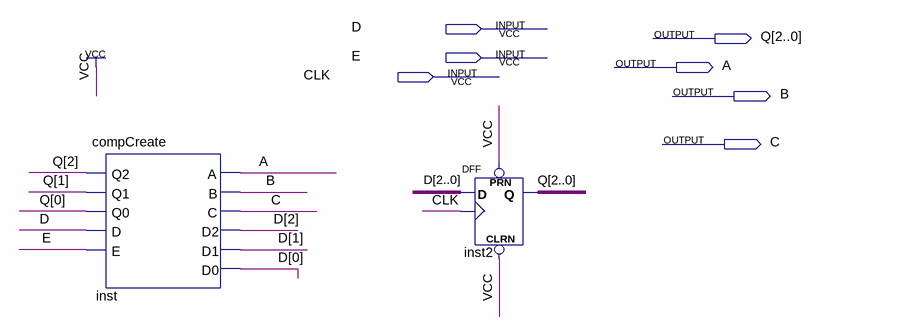
[diagram p0: schematic sheet]
// Quartus schematic Lab5_Quiz.bdf as structural Verilog: 2 symbols, 7 pins
module Lab5_Quiz (
  input  D,
  input  E,
  input  CLK,
  output [2:0] Q,
  output A,
  output B,
  output C
);

  wire [2:0] D_bus;

  compCreate inst (
    .Q2(Q[2]), .Q1(Q[1]), .Q0(Q[0]), .D(D), .E(E), .A(A), .B(B), .C(C), .D2(D_bus[2]), .D1(D_bus[1]),
    .D0(D_bus[0]));
  DFF inst2[2:0] (.CLRN(1'b1), .CLK(CLK), .D(D_bus), .PRN(1'b1), .Q(Q));
endmodule
